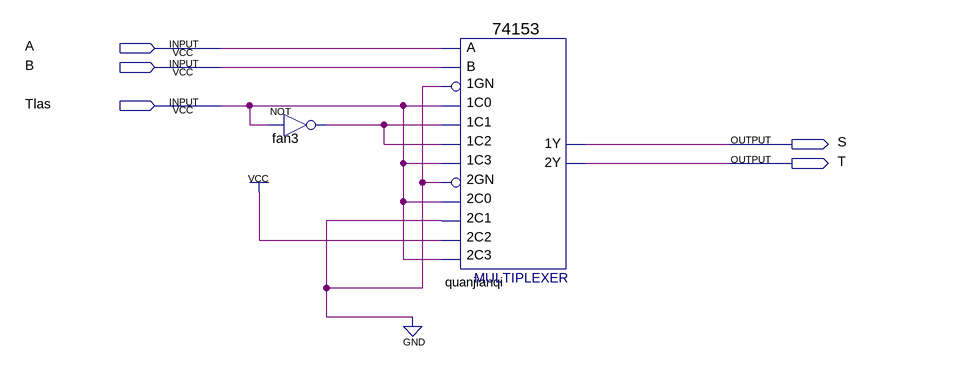
[diagram p0: schematic sheet]
// Quartus schematic Block2.bdf as structural Verilog: 2 symbols, 5 pins
module Block2 (
  input  A,
  input  B,
  input  Tlas,
  output S,
  output T
);

  wire fan3_out;

  not fan3 (fan3_out, Tlas);
  \74153  quanjianqi (
    .\1C1 (fan3_out), .\1GN (1'b0), .\1C0 (Tlas), .\2C0 (Tlas), .\2GN (1'b0), .\2C2 (1'b1), .\1C2 (fan3_out),
    .\1C3 (Tlas), .B(B), .A(A), .\2C1 (1'b0), .\2C3 (Tlas), .\1Y (S), .\2Y (T));
endmodule
